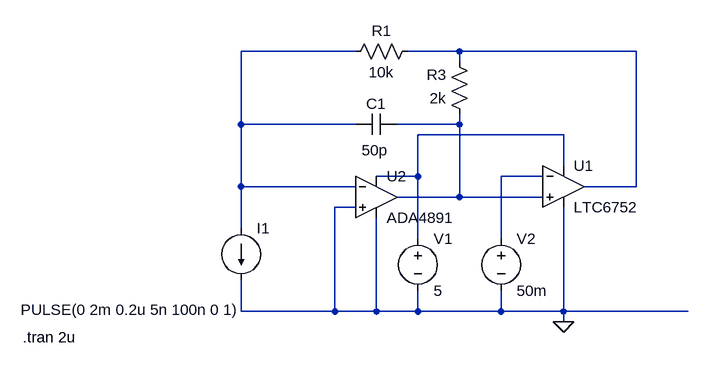
[diagram p0: schematic LTC6752_linear_discharge.asc]
LTC6752_linear_discharge.asc, the LTspice schematic file:
Version 4
SHEET 1 880 680
WIRE -96 -192 -272 -192
WIRE 64 -192 -16 -192
WIRE 336 -192 64 -192
WIRE 64 -176 64 -192
WIRE -272 -80 -272 -192
WIRE -96 -80 -272 -80
WIRE 64 -80 64 -96
WIRE 64 -80 -32 -80
WIRE 224 -64 0 -64
WIRE 224 -16 224 -64
WIRE 0 0 0 -64
WIRE 0 0 -64 0
WIRE 192 0 128 0
WIRE -272 16 -272 -80
WIRE -96 16 -272 16
WIRE 336 16 336 -192
WIRE 336 16 256 16
WIRE 64 32 64 -80
WIRE 64 32 -32 32
WIRE 192 32 64 32
WIRE -96 48 -128 48
WIRE -272 80 -272 16
WIRE 0 96 0 0
WIRE 128 96 128 0
WIRE -272 208 -272 160
WIRE -128 208 -128 48
WIRE -128 208 -272 208
WIRE -64 208 -64 64
WIRE -64 208 -128 208
WIRE 0 208 0 176
WIRE 0 208 -64 208
WIRE 128 208 128 176
WIRE 128 208 0 208
WIRE 224 208 224 48
WIRE 224 208 128 208
WIRE 416 208 224 208
WIRE 224 224 224 208
FLAG 224 224 0
SYMBOL Comparators\\LTC6752 224 -48 R0
SYMATTR InstName U1
SYMBOL current -272 80 R0
WINDOW 123 0 0 Left 0
WINDOW 39 0 0 Left 0
WINDOW 3 -339 125 Left 2
SYMATTR Value PULSE(0 2m 0.2u 5n 100n 0 1)
SYMATTR InstName I1
SYMBOL OpAmps\\ADA4891 -64 -32 R0
SYMATTR InstName U2
SYMBOL cap -32 -96 R90
WINDOW 0 0 32 VBottom 2
WINDOW 3 40 34 VTop 2
SYMATTR InstName C1
SYMATTR Value 50p
SYMBOL res 0 -208 R90
WINDOW 0 0 56 VBottom 2
WINDOW 3 32 56 VTop 2
SYMATTR InstName R1
SYMATTR Value 10k
SYMBOL voltage 0 80 R0
WINDOW 123 0 0 Left 0
WINDOW 39 0 0 Left 0
SYMATTR InstName V1
SYMATTR Value 5
SYMBOL voltage 128 80 R0
WINDOW 123 0 0 Left 0
WINDOW 39 0 0 Left 0
SYMATTR InstName V2
SYMATTR Value 50m
SYMBOL res 80 -80 R180
WINDOW 0 36 76 Left 2
WINDOW 3 36 40 Left 2
SYMATTR InstName R3
SYMATTR Value 2k
TEXT -608 248 Left 2 !.tran 2u

The netlist it stands for:
* LTC6752_linear_discharge.asc
XU1 N003 N005 N004 0 N002 LTC6752  ; pins In+ In- V+ V- OUT
I1 N001 0 PULSE(0 2m 0.2u 5n 100n 0 1)
XU2 0 N001 N004 0 N003 ADA4891-1  ; pins In+ In- V+ V- OUT
C1 N003 N001 50p
R1 N002 N001 10k
V1 N004 0 5
V2 N005 0 50m
R3 N003 N002 2k
.tran 2u
.lib LTC7.lib
.lib ADA4891-1.lib
.backanno
.end